# Altium schematic sheet GateDriver.SchDoc
size A3; SheetNumber: 3; SheetTotal: 4
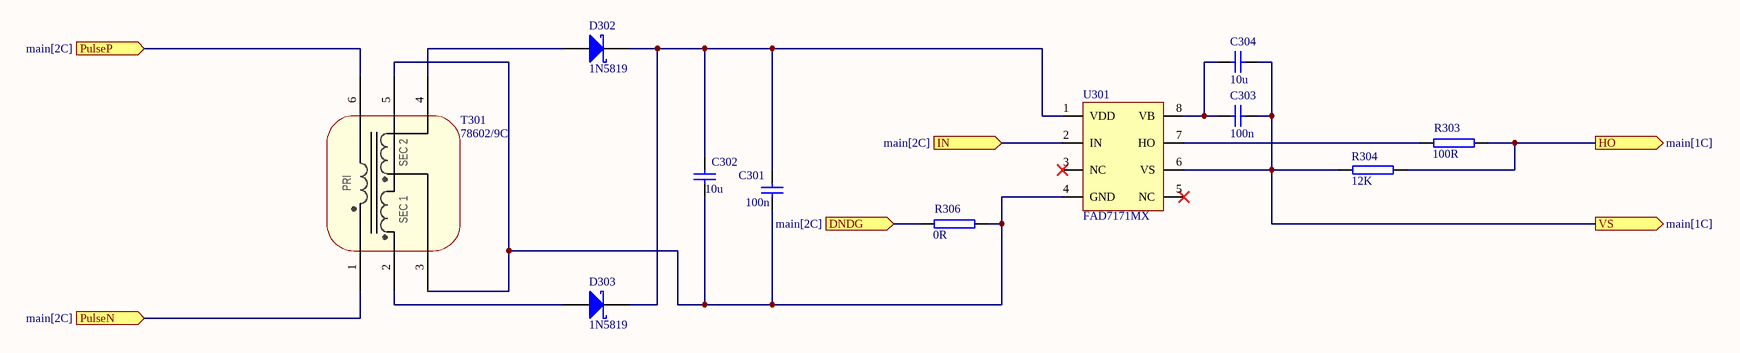
[diagram p0: GateDriver.SchDoc]

## Parts
C301  100n  [CAP_1206]
C302  10u  [CAP_1206]
C303  100n  [RAD-0.2_AUT]
C304  10u  [CAP_1206]
D302  1N5819  [DIODE0.4_AUT]
D303  1N5819  [DIODE0.4_AUT]
R303  100R  [RES_1206]
R304  12K  [RES_1206]
R306  0R  [RES_1206]
T301  78602/9C  [DIP6W_AUT]
U301  FAD7171MX  [SOIC8-M]

## Ports
DNDG (in, see main[2C]), HO (out, see main[1C]), IN (in, see main[2C]), PulseN (in, see main[2C]), PulseP (in, see main[2C]), VS (out, see main[1C])

## Nets
DNDG: R306.2 ; port DNDG
HO: R303.2 R304.1 ; port HO
IN: U301.2(IN) ; port IN
PulseN: T301.1(Pri_1) ; port PulseN
PulseP: T301.6(Pri2) ; port PulseP
VS: C303.2 C304.1 R304.2 U301.6(VS) ; port VS
NetC301_1: C301.1 C302.1 R306.1 T301.3(Sec1_2) T301.5(Sec1_2) U301.4(GND)
NetC301_2: C301.2 C302.2 D302.K D303.K U301.1(VDD)
NetC303_1: C303.1 C304.2 U301.8(VB)
NetD302_A: D302.A T301.4(Sec2_2)
NetD303_A: D303.A T301.2(Sec1_1)
NetR303_1: R303.1 U301.7(HO)

Not connected (* = marked no-connect by the designer): U301 3(NC)* 5(NC)*

## Notes on the sheet
- (in symbol 78602/9C) SEC 2; PRI; SEC 1

## Library data of the parts
C301 C302 C304 = CAPN 1206: Non Polarized Capacitor, SMD, 1206
C303 = CAPN RAD0.2: Non Polarized Capacitor, Multilayer Ceramic Dipped Radial, Pitch 200mil
D302 D303 = 1N5819: Schottky Diode, 1A,40v; Supplier 1: Farnell; Supplier Part Number 1: 1017589
R303 R304 R306 = Resistor 1206: Resistor, SMD, 1206
T301 = 78602/9C: Pulse transformer 1:1:1
U301 = FAD7171MX: High-Side Gate Driver IC Non-Inverting PG-DSO-8 / 8-SOIC (0.154", 3.90mm Width) / https://www.digikey.co.nz/en/products/detail/onsemi/FAD7171MX/24627314